# Altium schematic sheet Sheet1.SchDoc
size A4; SheetNumber: 1; SheetTotal: 1
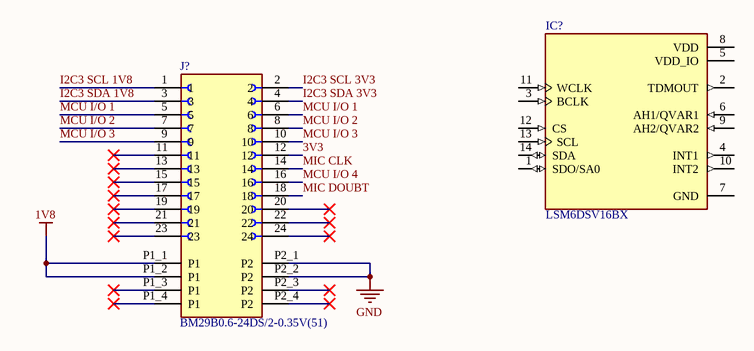
[diagram p0: Sheet1.SchDoc]

## Parts
IC?  LSM6DSV16BX  [PQFN50P250X300X74-14N]
J?  BM29B0.6-24DS/2-0.35V(51)  [HRS_BM29B0.6-24DS/2-0.35V(51)]

## Nets
1V8: J?.P1_1(P1) J?.P1_2(P1)
GND: J?.P2_1(P2) J?.P2_2(P2)
3V3: J?.12
I2C3 SCL 1V8: J?.1
I2C3 SCL 3V3: J?.2
I2C3 SDA 1V8: J?.3
I2C3 SDA 3V3: J?.4
MCU I/O 1: J?.5 J?.6
MCU I/O 2: J?.7 J?.8
MCU I/O 3: J?.9 J?.10
MCU I/O 4: J?.16
MIC CLK: J?.14
MIC DOUBT: J?.18

Not connected (* = marked no-connect by the designer): IC? 1(SDO/SA0) 2(TDMOUT) 3(BCLK) 4(INT1) 5(VDD_IO) 6(AH1/QVAR1) 7(GND) 8(VDD) 9(AH2/QVAR2) 10(INT2) 11(WCLK) 12(CS) 13(SCL) 14(SDA); J? 11* 13* 15* 17* 19* 20* 21* 22* 23* 24* P1_3(P1)* P1_4(P1)* P2_3(P2)* P2_4(P2)*

## Library data of the parts
IC? = LSM6DSV16BXTR: Accelerometer, Gyroscope, Temperature, 6 Axis Sensor IÂ²C, I3Câ„ , SPI Output; MF: STMicroelectronics; SnapEDA_Link: https://www.snapeda.com/parts/LSM6DSV16BXTR/STMicroelectronics/view-part/?ref=snap; Package: LGA-14 STMicroelectronics; Value: *; MP: LSM6DSV16BXTR; Check_prices: https://www.snapeda.com/parts/LSM6DSV16BXTR/STMicroelectronics/view-part/?ref=eda; Supplier 1: RS; Supplier Part Number 1: 2615021
J? = BM29B0.6-24DS/2-0.35V(51): 26 (24 + 2 Power) Position Connector Receptacle, Center Strip Contacts Surface Mount Gold; MF: Hirose Connector; SnapEDA_Link: https://www.snapeda.com/parts/BM29B0.6-24DS/2-0.35V(51)/Hirose/view-part/?ref=snap; Package: None; Value: *; MP: BM29B0.6-24DS/2-0.35V(51); Check_prices: https://www.snapeda.com/parts/BM29B0.6-24DS/2-0.35V(51)/Hirose/view-part/?ref=eda